# Altium schematic sheet Interface_CLPToDigital.SchDoc
size A4
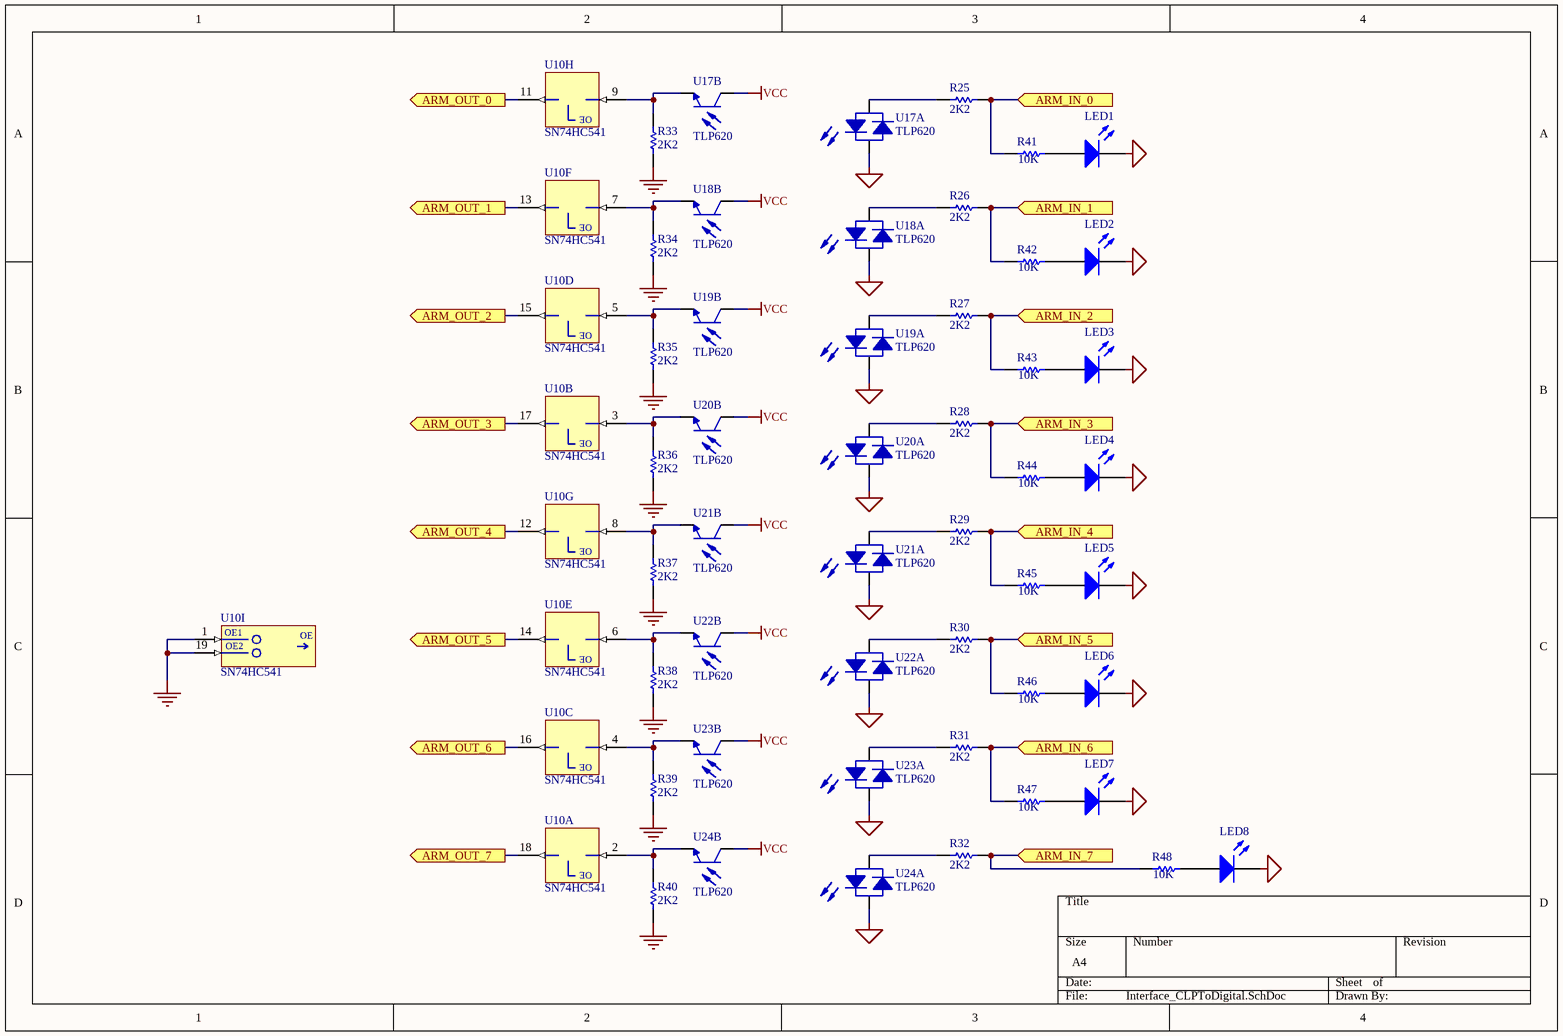
[diagram p0: Interface_CLPToDigital.SchDoc]

## Parts
LED1  151053YS04500  [Type 5mm]  (value not drawn)
LED2  151053YS04500  [Type 5mm]  (value not drawn)
LED3  151053YS04500  [Type 5mm]  (value not drawn)
LED4  151053YS04500  [Type 5mm]  (value not drawn)
LED5  151053YS04500  [Type 5mm]  (value not drawn)
LED6  151053YS04500  [Type 5mm]  (value not drawn)
LED7  151053YS04500  [Type 5mm]  (value not drawn)
LED8  151053YS04500  [Type 5mm]  (value not drawn)
R25  2K2  [CR25]
R26  2K2  [CR25]
R27  2K2  [CR25]
R28  2K2  [CR25]
R29  2K2  [CR25]
R30  2K2  [CR25]
R31  2K2  [CR25]
R32  2K2  [CR25]
R33  2K2  [CR25]
R34  2K2  [CR25]
R35  2K2  [CR25]
R36  2K2  [CR25]
R37  2K2  [CR25]
R38  2K2  [CR25]
R39  2K2  [CR25]
R40  2K2  [CR25]
R41  value 10K  [AXIAL-0.5]  (hidden comment: 1)
R42  value 10K  [AXIAL-0.5]  (hidden comment: Res1)
R43  value 10K  [AXIAL-0.5]  (hidden comment: Res1)
R44  value 10K  [AXIAL-0.5]  (hidden comment: Res1)
R45  value 10K  [AXIAL-0.5]  (hidden comment: Res1)
R46  value 10K  [AXIAL-0.5]  (hidden comment: Res1)
R47  value 10K  [AXIAL-0.5]  (hidden comment: Res1)
R48  value 10K  [AXIAL-0.3]  (hidden comment: Res1)
U10  SN74HC541  [PDIP20]  (parts A,B,C,D,E,F,G,H,I of 10)
U17  TLP620  [DIP4]  (parts A,B of 2)
U18  TLP620  [DIP4]  (parts A,B of 2)
U19  TLP620  [DIP4]  (parts A,B of 2)
U20  TLP620  [DIP4]  (parts A,B of 2)
U21  TLP620  [DIP4]  (parts A,B of 2)
U22  TLP620  [DIP4]  (parts A,B of 2)
U23  TLP620  [DIP4]  (parts A,B of 2)
U24  TLP620  [DIP4]  (parts A,B of 2)

## Ports
ARM_IN_0 (in), ARM_IN_1 (in), ARM_IN_2 (in), ARM_IN_3 (in), ARM_IN_4 (in), ARM_IN_5 (in), ARM_IN_6 (in), ARM_IN_7 (in), ARM_OUT_0 (out), ARM_OUT_1 (out), ARM_OUT_2 (out), ARM_OUT_3 (out), ARM_OUT_4 (out), ARM_OUT_5 (out), ARM_OUT_6 (out), ARM_OUT_7 (out)

## Nets
CLP_GND: LED1.1(K) LED2.1(K) LED3.1(K) LED4.1(K) LED5.1(K) LED6.1(K) LED7.1(K) LED8.1(K) U17.2 U18.2 U19.2 U20.2 U21.2 U22.2 U23.2 U24.2
GND: R33.1 R34.1 R35.2 R36.1 R37.1 R38.1 R39.1 R40.1 U10.1(OE1) U10.19(OE2)
VCC: U17.4 U18.4 U19.4 U20.4 U21.4 U22.4 U23.4 U24.4
ARM_IN_0: R25.2 R41.2 ; port ARM_IN_0
ARM_IN_1: R26.2 R42.2 ; port ARM_IN_1
ARM_IN_2: R27.2 R43.2 ; port ARM_IN_2
ARM_IN_3: R28.2 R44.2 ; port ARM_IN_3
ARM_IN_4: R29.2 R45.2 ; port ARM_IN_4
ARM_IN_5: R30.2 R46.2 ; port ARM_IN_5
ARM_IN_6: R31.2 R47.2 ; port ARM_IN_6
ARM_IN_7: R32.2 R48.2 ; port ARM_IN_7
ARM_OUT_0: U10.11(Y8) ; port ARM_OUT_0
ARM_OUT_1: U10.13(Y6) ; port ARM_OUT_1
ARM_OUT_2: U10.15(Y4) ; port ARM_OUT_2
ARM_OUT_3: U10.17(Y2) ; port ARM_OUT_3
ARM_OUT_4: U10.12(Y7) ; port ARM_OUT_4
ARM_OUT_5: U10.14(Y5) ; port ARM_OUT_5
ARM_OUT_6: U10.16(Y3) ; port ARM_OUT_6
ARM_OUT_7: U10.18(Y1) ; port ARM_OUT_7
NetLED1_2: LED1.2(A) R41.1
NetLED2_2: LED2.2(A) R42.1
NetLED3_2: LED3.2(A) R43.1
NetLED4_2: LED4.2(A) R44.1
NetLED5_2: LED5.2(A) R45.1
NetLED6_2: LED6.2(A) R46.1
NetLED7_2: LED7.2(A) R47.1
NetLED8_2: LED8.2(A) R48.1
NetR25_1: R25.1 U17.1
NetR26_1: R26.1 U18.1
NetR27_1: R27.1 U19.1
NetR28_1: R28.1 U20.1
NetR29_1: R29.1 U21.1
NetR30_1: R30.1 U22.1
NetR31_1: R31.1 U23.1
NetR32_1: R32.1 U24.1
NetR33_2: R33.2 U10.9(A8) U17.3
NetR34_2: R34.2 U10.7(A6) U18.3
NetR35_1: R35.1 U10.5(A4) U19.3
NetR36_2: R36.2 U10.3(A2) U20.3
NetR37_2: R37.2 U10.8(A7) U21.3
NetR38_2: R38.2 U10.6(A5) U22.3
NetR39_2: R39.2 U10.4(A3) U23.3
NetR40_2: R40.2 U10.2(A1) U24.3

## Notes on the sheet
- (in symbol SN74HC541, part A) OE
- (in symbol SN74HC541, part B) OE
- (in symbol SN74HC541, part C) OE
- (in symbol SN74HC541, part D) OE
- (in symbol SN74HC541, part E) OE
- (in symbol SN74HC541, part F) OE
- (in symbol SN74HC541, part G) OE
- (in symbol SN74HC541, part H) OE
- (in symbol SN74HC541, part I) OE

## Library data of the parts
LED1-LED8 = CMP-1477-00001-1: THT LED round mono-color waterclear, WL-TMRW, Yellow; Manufacturer: Wuerth Elektronik; ComponentLink2URL: http://katalog.we-online.de/pbs/datasheet/7448042001.pdfhttp://katalog.we-online.de/pbs/datasheet/7448042001.pdfhttp://katalog.we-online.de/pbs/datasheet/7448042001.pdfhttp://katalog.we-online.de/pbs/datasheet/151053YS04500.pdf; Emitting color: Yellow; PackageReference: Type 5mm; ComponentLink1URL: http://www.we-online.com; PartNumber: 151053YS04500; ComponentLink2Description: Datasheet; ComponentLink1Description: Manufacturer URL
R25-R40 = Resistor
R41-R48 = Res1: Resistor; Published: 8-Jun-2000; LatestRevisionDate: 17-Jul-2002; LatestRevisionNote: Re-released for DXP Platform.; PackageReference: AXIAL-0.3; Publisher: Altium Limited; PackageDescription: Axial Device, Thru-Hole; 2 Leads; 0.3 in Pin Spacing
U10 = SN74HC541: Octal Buffers and Line Drivers With 3-State Outputs
U17-U24 = TLP620: TOSHIBA Photocoupler